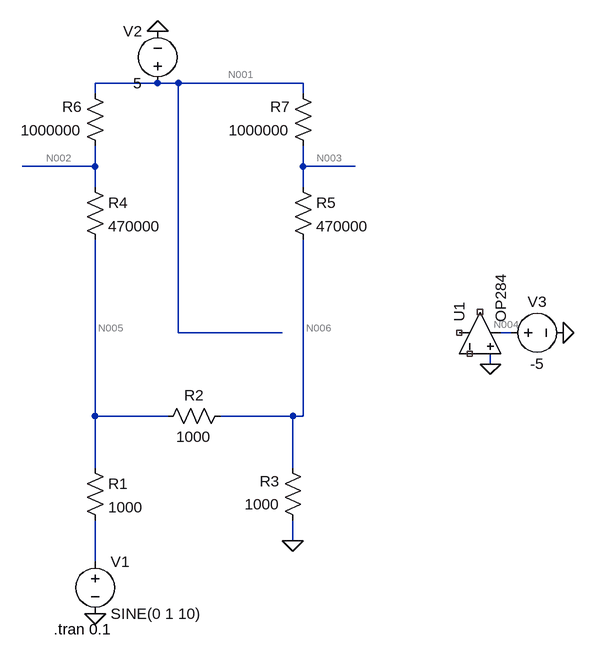
[diagram p0: schematic Draft1.asc]
Draft1.asc, the LTspice schematic file:
Version 4
SHEET 1 984 680
WIRE 208 -624 112 -624
WIRE 240 -624 208 -624
WIRE 432 -624 240 -624
WIRE 112 -608 112 -624
WIRE 432 -608 432 -624
WIRE 112 -496 112 -528
WIRE 112 -496 0 -496
WIRE 432 -496 432 -528
WIRE 512 -496 432 -496
WIRE 112 -464 112 -496
WIRE 432 -464 432 -496
WIRE 240 -240 240 -624
WIRE 400 -240 240 -240
WIRE 752 -240 736 -240
WIRE 720 -192 720 -208
WIRE 112 -112 112 -384
WIRE 224 -112 112 -112
WIRE 416 -112 304 -112
WIRE 432 -112 432 -384
WIRE 432 -112 416 -112
WIRE 112 -32 112 -112
WIRE 416 -32 416 -112
WIRE 416 80 416 48
WIRE 112 112 112 48
FLAG 112 192 0
FLAG 416 80 0
FLAG 208 -704 0
FLAG 832 -240 0
FLAG 720 -192 0
SYMBOL voltage 112 96 R0
WINDOW 123 0 0 Left 0
WINDOW 39 0 0 Left 0
SYMATTR InstName V1
SYMATTR Value SINE(0 1 10)
SYMBOL res 96 -48 R0
SYMATTR InstName R1
SYMATTR Value 1000
SYMBOL res 320 -128 R90
WINDOW 0 0 56 VBottom 2
WINDOW 3 32 56 VTop 2
SYMATTR InstName R2
SYMATTR Value 1000
SYMBOL res 432 64 R180
WINDOW 0 36 76 Left 2
WINDOW 3 36 40 Left 2
SYMATTR InstName R3
SYMATTR Value 1000
SYMBOL res 96 -480 R0
SYMATTR InstName R4
SYMATTR Value 470000
SYMBOL res 416 -480 R0
SYMATTR InstName R5
SYMATTR Value 470000
SYMBOL res 128 -512 R180
WINDOW 0 36 76 Left 2
WINDOW 3 36 40 Left 2
SYMATTR InstName R6
SYMATTR Value 1000000
SYMBOL res 448 -512 R180
WINDOW 0 36 76 Left 2
WINDOW 3 36 40 Left 2
SYMATTR InstName R7
SYMATTR Value 1000000
SYMBOL voltage 208 -608 R180
WINDOW 0 24 96 Left 2
WINDOW 3 24 16 Left 2
WINDOW 123 0 0 Left 0
WINDOW 39 0 0 Left 0
SYMATTR InstName V2
SYMATTR Value 5
SYMBOL Opamps\\OP284 640 -240 R270
SYMATTR InstName U1
SYMBOL voltage 736 -240 R270
WINDOW 0 32 56 VTop 2
WINDOW 3 -32 56 VBottom 2
WINDOW 123 0 0 Left 0
WINDOW 39 0 0 Left 0
SYMATTR InstName V3
SYMATTR Value -5
TEXT 48 216 Left 2 !.tran 0.1

The netlist it stands for:
* Draft1.asc
V1 N007 0 SINE(0 1 10)
R1 N005 N007 1000
R2 N006 N005 1000
R3 0 N006 1000
R4 N002 N005 470000
R5 N003 N006 470000
R6 N002 N001 1000000
R7 N003 N001 1000000
V2 N001 0 5
XU1 0 NC_01 NC_02 N004 NC_03 OP284  ; pins In+ In- V+ V- OUT
V3 N004 0 -5
.tran 0.1
.lib ADI1.lib
.backanno
.end

* Results of the author's LTspice run, read from the files saved beside the schematic
* Operating Point, zero values left out:
*   V(n005) = 3.399 mV
*   V(n006) = 3.399 mV
*   V(n002) = 1.601 V
*   V(n003) = 1.601 V
*   V(n001) = 5 V
*   V(n004) = -5 V
*   I(R7) = -3.399 µA
*   I(R6) = -3.399 µA
*   I(R5) = 3.399 µA
*   I(R4) = 3.399 µA
*   I(R3) = -3.399 µA
*   I(R1) = 3.399 µA
*   I(V3) = 599.8 µA
*   I(V2) = -6.798 µA
*   I(V1) = 3.399 µA
*   Ix(u1:1) = 599.8 µA
*   Ix(u1:50) = -599.8 µA
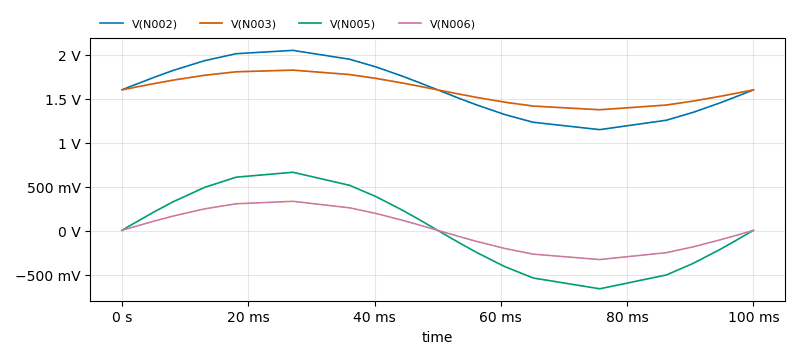
[diagram p1: Transient Analysis of Draft1.asc, plotted from the saved traces]
* Transient Analysis, 1 run:
*   V(N002): min 1.149 V, max 2.05 V, average 1.602 V, rms 1.633 V, last 1.601 V
*   V(N003): min 1.375 V, max 1.825 V, average 1.602 V, rms 1.609 V, last 1.601 V
*   V(N005): min -661.6 mV, max 663.7 mV, average 5.045 mV, rms 462.7 mV, last 3.399 mV
*   V(N006): min -329 mV, max 333.4 mV, average 4.222 mV, rms 231.3 mV, last 3.399 mV